# Altium schematic sheet SensorRotacaoMotor.SchDoc
size A3
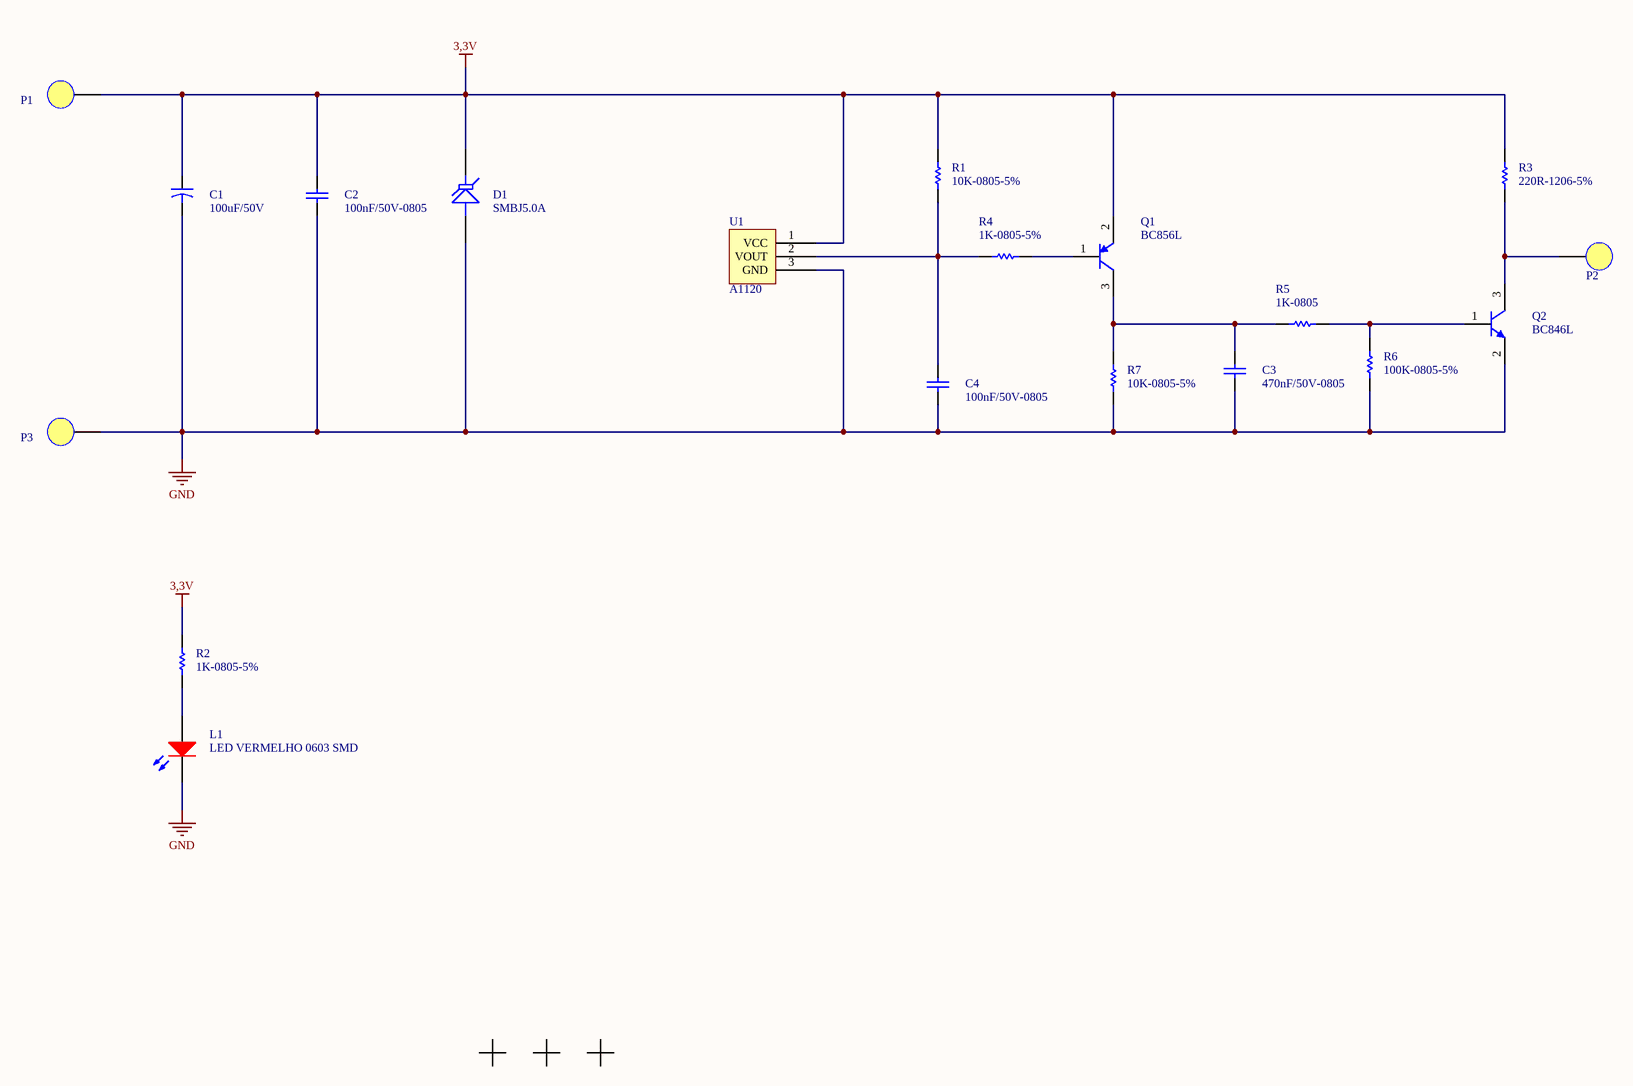
[diagram p0: SensorRotacaoMotor.SchDoc]

## Parts
C1  100uF/50V  [CAP POL 8x12mm]
C2  100nF/50V-0805  [0805-REVISADO ONDA]
C3  470nF/50V-0805  [0805-REVISADO ONDA]
C4  100nF/50V-0805  [0805-REVISADO ONDA]
D1  SMBJ5.0A  [DO-214AA]
FD1  FID  [FIDUCIAL]  (value not drawn)
FD2  FID  [FIDUCIAL]  (value not drawn)
FD3  FID  [FIDUCIAL]  (value not drawn)
L1  LED VERMELHO 0603 SMD  [LED 0805 - REVISADO ONDA]
P1  PAD  [PAD 3,5]  (value not drawn)
P2  PAD  [PAD 3,5]  (value not drawn)
P3  PAD  [PAD 3,5]  (value not drawn)
Q1  BC856L  [SOT23 - REVISADO ONDA]
Q2  BC846L  [SOT23 - REVISADO ONDA]
R1  10K-0805-5%  [0805-REVISADO ONDA]
R2  1K-0805-5%  [0805-REVISADO ONDA]
R3  220R-1206-5%  [1206-REVISADO ONDA]
R4  1K-0805-5%  [0805-REVISADO ONDA]
R5  1K-0805  [0805-REVISADO ONDA]
R6  100K-0805-5%  [0805-REVISADO ONDA]
R7  10K-0805-5%  [0805-REVISADO ONDA]
U1  A1120  [SOT23 - REVISADO ONDA]

## Nets
3,3V: C1.1 C2.2 D1.2(K) P1.1 Q1.2(E) R1.2 R2.2 R3.2 U1.1(VCC)
GND: C1.2 C2.1 C3.1 C4.1 D1.1(A) L1.2(K) P3.1 Q2.2(E) R6.2 R7.1 U1.3(GND)
NetC3_2: C3.2 Q1.3(C) R5.2 R7.2
NetC4_2: C4.2 R1.1 R4.2 U1.2(VOUT)
NetL1_1: L1.1(A) R2.1
NetP2_1: P2.1 Q2.3(C) R3.1
NetQ1_1: Q1.1(B) R4.1
NetQ2_1: Q2.1(B) R5.1 R6.1

## Notes on the sheet
- NOME
- DATA
- PROJETO
- DESCRIÇÃO
- desenho
- verif.
- aprov.
- TAMANHO
- CODIGO
- Todas as informações disponíveis
- não devem ser divulgadas,
- em parte ou todo.
- CIRCUITO IMPRESSO
- MONTAGEM ELETRÔNICA
- A4
- de

## Library data of the parts
C2 C4 = 100nF/50-0805-NPO: ERP: 104.11.005
C3 = 100nF/50-0805-NPO: 100nF/50V-0805; ERP: 104.11.005
FD1-FD3 = FIDUCIAL
Q2 = BC846: ERP: 106.22.001
R3 R5 R6 = 10K-0805-5%: ERP: 102.11.054
C1 = 100uF/50V: ERP: 105.01.003
D1 = SMBJ5.0A: ERP: 128.02.002
L1 = LED VERMELHO 0603 SMD: ERP: 124.02.010
Q1 = BC856L: ERP: 106.22.002
R1 R7 = 10K-0805-5%: ERP: 102.11.054
R2 R4 = 1K-0805-5%: ERP: 102.11.042